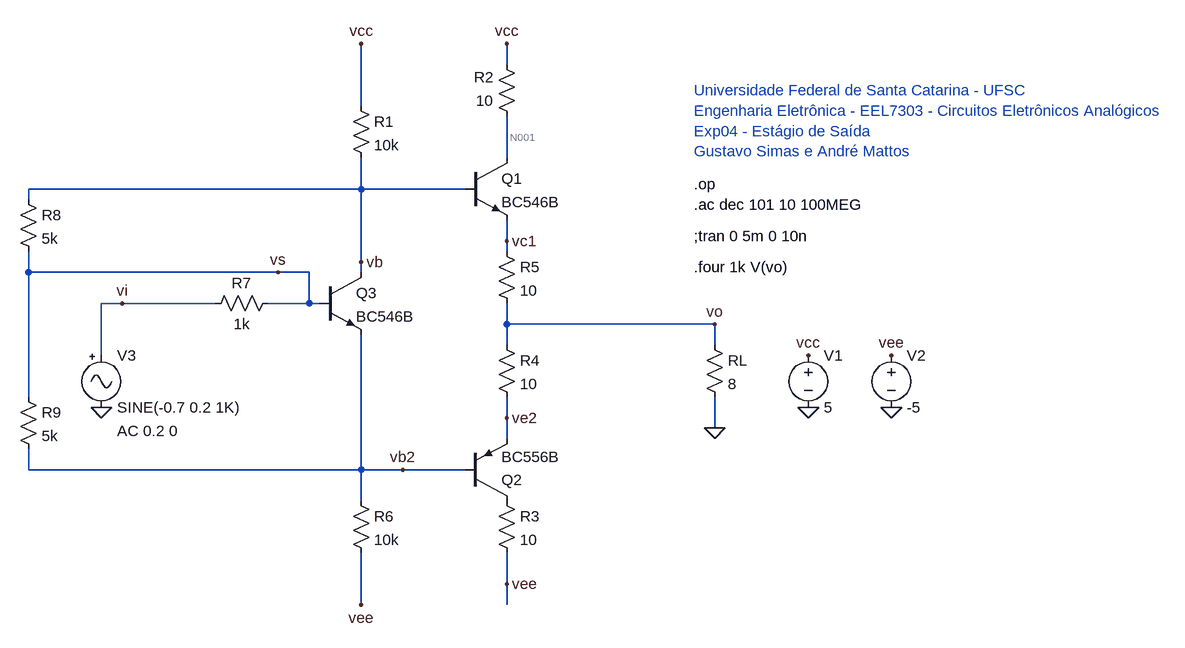
[diagram p0: schematic Lab04_2.asc]
Lab04_2.asc, the LTspice schematic file:
Version 4
SHEET 1 1608 948
WIRE 544 32 544 0
WIRE 320 96 320 0
WIRE 544 176 544 112
WIRE 320 224 320 176
WIRE 320 224 -192 224
WIRE 480 224 320 224
WIRE -192 240 -192 224
WIRE 544 304 544 272
WIRE 544 320 544 304
WIRE 320 336 320 224
WIRE -192 352 -192 320
WIRE 192 352 -192 352
WIRE 240 352 192 352
WIRE 320 352 320 336
WIRE -48 400 -80 400
WIRE 96 400 -48 400
WIRE 240 400 240 352
WIRE 240 400 176 400
WIRE 256 400 240 400
WIRE 544 432 544 400
WIRE 864 432 544 432
WIRE 544 464 544 432
WIRE 864 464 864 432
WIRE -80 480 -80 400
WIRE -192 544 -192 352
WIRE 544 576 544 544
WIRE 864 592 864 544
WIRE 544 608 544 576
WIRE -192 656 -192 624
WIRE 320 656 320 448
WIRE 320 656 -192 656
WIRE 384 656 320 656
WIRE 480 656 384 656
WIRE 320 704 320 656
WIRE 544 832 544 784
WIRE 320 864 320 784
WIRE 544 864 544 832
FLAG 1008 560 0
FLAG 1136 560 0
FLAG 1008 480 vcc
FLAG 1136 480 vee
FLAG 544 0 vcc
FLAG 544 832 vee
FLAG 864 592 0
FLAG 320 336 vb
FLAG 864 432 vo
FLAG 320 0 vcc
FLAG 320 864 vee
FLAG -80 560 0
FLAG 544 304 vc1
FLAG -48 400 vi
FLAG 192 352 vs
FLAG 544 576 ve2
FLAG 384 656 vb2
SYMBOL npn 480 176 R0
SYMATTR InstName Q1
SYMATTR Value BC546B
SYMBOL pnp 480 704 M180
SYMATTR InstName Q2
SYMATTR Value BC556B
SYMBOL res 560 128 R180
WINDOW 0 36 76 Left 2
WINDOW 3 36 40 Left 2
SYMATTR InstName R2
SYMATTR Value 10
SYMBOL voltage 1008 464 R0
WINDOW 123 0 0 Left 0
WINDOW 39 0 0 Left 0
SYMATTR InstName V1
SYMATTR Value 5
SYMBOL voltage 1136 464 R0
WINDOW 123 0 0 Left 0
WINDOW 39 0 0 Left 0
SYMATTR InstName V2
SYMATTR Value -5
SYMBOL res 848 448 R0
SYMATTR InstName RL
SYMATTR Value 8
SYMBOL res 528 688 R0
SYMATTR InstName R3
SYMATTR Value 10
SYMBOL res 528 448 R0
SYMATTR InstName R4
SYMATTR Value 10
SYMBOL res 528 304 R0
SYMATTR InstName R5
SYMATTR Value 10
SYMBOL npn 256 352 R0
SYMATTR InstName Q3
SYMATTR Value BC546B
SYMBOL res 304 80 R0
SYMATTR InstName R1
SYMATTR Value 10k
SYMBOL res 304 688 R0
SYMATTR InstName R6
SYMATTR Value 10k
SYMBOL res 192 384 R90
WINDOW 0 0 56 VBottom 2
WINDOW 3 32 56 VTop 2
SYMATTR InstName R7
SYMATTR Value 1k
SYMBOL Misc\\signal -80 464 R0
WINDOW 123 24 132 Left 2
WINDOW 39 0 0 Left 0
SYMATTR Value2 AC 0.2 0
SYMATTR InstName V3
SYMATTR Value SINE(-0.7 0.2 1K)
SYMBOL res -208 528 R0
SYMATTR InstName R9
SYMATTR Value 5k
SYMBOL res -208 224 R0
SYMATTR InstName R8
SYMATTR Value 5k
TEXT 832 216 Left 2 !.op
TEXT 832 72 Left 2 ;Universidade Federal de Santa Catarina - UFSC\nEngenharia Eletrônica - EEL7303 - Circuitos Eletrônicos Analógicos\nExp04 - Estágio de Saída\nGustavo Simas e André Mattos
TEXT 832 248 Left 2 !.ac dec 101 10 100MEG
TEXT 832 296 Left 2 !;tran 0 5m 0 10n
TEXT 832 344 Left 2 !.four 1k V(vo)

The netlist it stands for:
* Lab04_2.asc
Q1 N001 vb vc1 0 BC546B
Q2 P001 vb2 ve2 0 BC556B
R2 N001 vcc 10
V1 vcc 0 5
V2 vee 0 -5
RL vo 0 8
R3 P001 vee 10
R4 vo ve2 10
R5 vc1 vo 10
Q3 vb vs vb2 0 BC546B
R1 vcc vb 10k
R6 vb2 vee 10k
R7 vs vi 1k
V3 vi 0 SINE(-0.7 0.2 1K) AC 0.2 0
R9 vs vb2 5k
R8 vb vs 5k
.model NPN NPN
.model PNP PNP
.lib standard.bjt
.op
* Universidade Federal de Santa Catarina - UFSC
* Engenharia Eletrônica - EEL7303 - Circuitos Eletrônicos Analógicos
* Exp04 - Estágio de Saída
* Gustavo Simas e André Mattos
.ac dec 101 10 100MEG
;tran 0 5m 0 10n
.four 1k V(vo)
.backanno
.end

* Results of the author's LTspice run, read from the files saved beside the schematic
* Operating Point, zero values left out:
*   V(n001) = 4.92 V
*   V(vb) = 617.5 mV
*   V(vc1) = -78.61 mV
*   V(p001) = -4.722 V
*   V(vb2) = -1.171 V
*   V(ve2) = -438.5 mV
*   V(vcc) = 5 V
*   V(vee) = -5 V
*   V(vo) = -159.1 mV
*   V(vs) = -579.5 mV
*   V(vi) = -700 mV
*   Ic(Q2) = -27.85 mA
*   Ib(Q2) = -92.86 µA
*   Ie(Q2) = 27.94 mA
*   Ic(Q3) = 171 µA
*   Ib(Q3) = 594.2 nA
*   Ie(Q3) = -171.6 µA
*   Ic(Q1) = 8.023 mA
*   Ib(Q1) = 27.79 µA
*   Ie(Q1) = -8.051 mA
*   I(R8) = 239.4 µA
*   I(R9) = 118.4 µA
*   I(R7) = 120.5 µA
*   I(R6) = 382.9 µA
*   I(R1) = 438.2 µA
*   I(R5) = 8.051 mA
*   I(R4) = 27.94 mA
*   I(R3) = 27.85 mA
*   I(Rl) = -19.89 mA
*   I(R2) = -8.023 mA
*   I(V3) = 120.5 µA
*   I(V2) = 28.23 mA
*   I(V1) = -8.461 mA
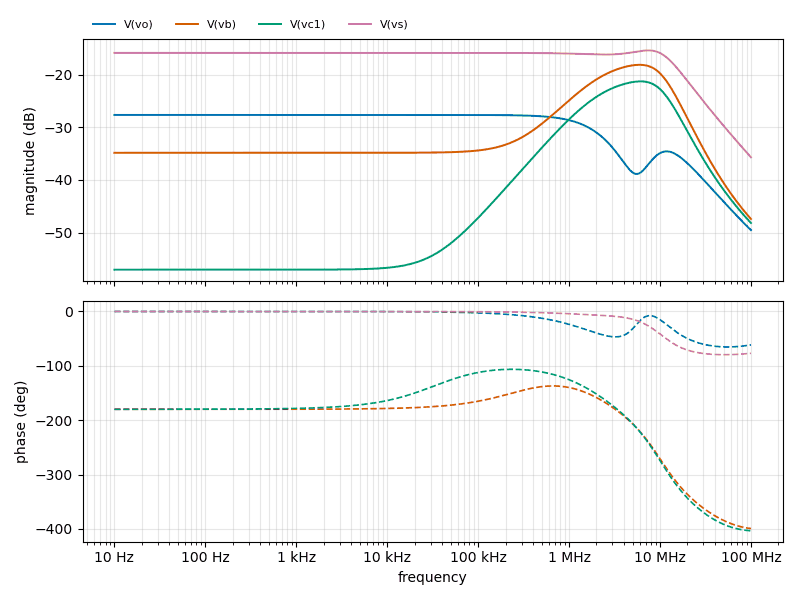
[diagram p1: AC Analysis of Lab04_2.asc, plotted from the saved traces]
* AC Analysis, 1 run:
*   V(vo): -27.62 dB at 10 Hz, -49.54 dB at 100 MHz, peak -27.62 dB at 10 Hz, 3 dB below the peak at 1.872 MHz
*   V(vb): -34.82 dB at 10 Hz, -47.42 dB at 100 MHz, peak -18.07 dB at 5.919 MHz, 3 dB below the peak at 1.903 MHz and 11.67 MHz
*   V(vc1): -57.08 dB at 10 Hz, -48.18 dB at 100 MHz, peak -21.23 dB at 6.056 MHz, 3 dB below the peak at 1.972 MHz and 11.95 MHz
*   V(vs): -15.80 dB at 10 Hz, -35.68 dB at 100 MHz, peak -15.33 dB at 7.435 MHz, 3 dB below the peak at 14.77 MHz
* From the log:
*   Semiconductor Device Operating Points:
*                           --- Bipolar Transistors ---
*   Name:       q2          q3          q1
*   Model:    bc556b      bc546b      bc546b
*   Ib:      -9.29e-05    5.94e-07    2.78e-05
*   Ic:      -2.78e-02    1.71e-04    8.02e-03
*   Vbe:     -7.33e-01    5.92e-01    6.96e-01
*   Vbc:      3.55e+00   -1.20e+00   -4.30e+00
*   Vce:     -4.28e+00    1.79e+00    5.00e+00
*   BetaDC:   3.00e+02    2.88e+02    2.89e+02
*   Gm:       8.65e-01    6.54e-03    2.92e-01
*   Rpi:      2.82e+02    4.41e+04    9.40e+02
*   Rx:       1.00e+00    1.00e+00    1.00e+00
*   Ro:       8.68e+02    3.68e+05    8.20e+03
*   Cbe:      6.21e-10    3.29e-11    2.00e-10
*   Cbc:      1.90e-12    1.53e-12    1.12e-12
*   Cjs:      0.00e+00    0.00e+00    0.00e+00
*   BetaAC:   2.44e+02    2.89e+02    2.74e+02
*   Cbx:      1.12e-12    9.43e-13    6.86e-13
*   Ft:       2.21e+08    2.95e+07    2.30e+08
*   Note: .fourier statements are only valid with a .tran command.
*         No Fourier analysis performed.